# EasyEDA schematic P01_POWER_USB.json
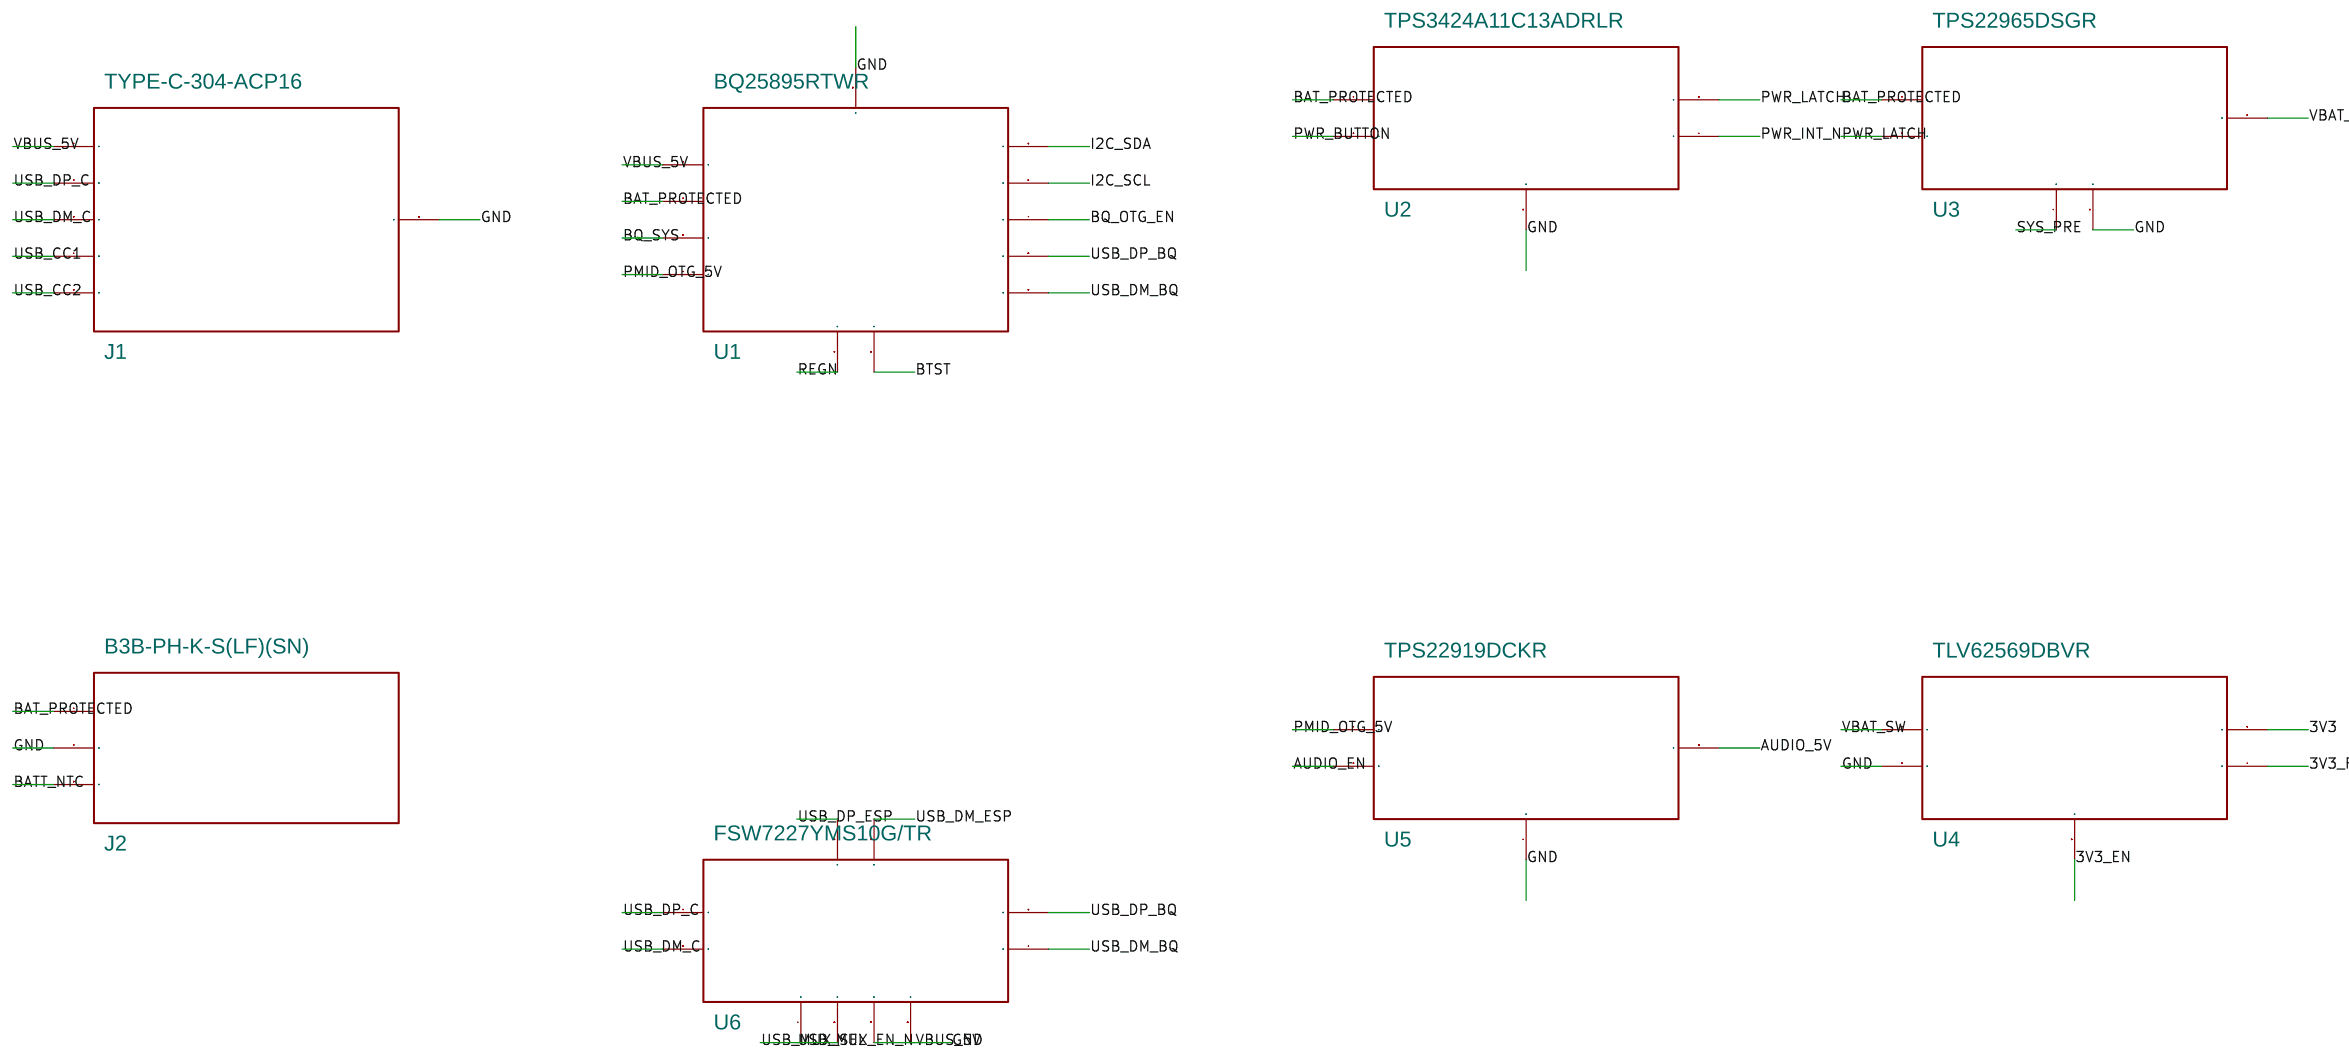
[diagram p0: schematic sheet]

## Parts
J1  TYPE-C-304-ACP16  [USB-C-16P]
J2  B3B-PH-K-S(LF)(SN)  [JST-PH-3P]
U1  BQ25895RTWR  [WQFN-24]
U2  TPS3424A11C13ADRLR  [VSON-8]
U3  TPS22965DSGR  [WSON-8]
U4  TLV62569DBVR  [SOT-23-5]
U5  TPS22919DCKR  [SC-70-6]
U6  FSW7227YMS10G/TR  [MSOP-10]

## Library data of the parts
J1 J2 = Connector
U1 = BQ25895
U2 = Pushbutton_Controller
U3 U5 = Load_Switch
U4 = Buck_Regulator
U6 = USB2_Mux

## Nets
3V3: U4.3(1)
3V3_EN: U4.5(1)
3V3_FB: U4.4(1)
GND: J1.1 J1.6(1) J2.2(1) U1.1 U1.10(1) U2.5(1) U3.5(1) U4.2(1) U5.4(1) U6.9(1) U6.10(1)
VBAT_SW: U3.3(1) U4.1
AUDIO_5V: U5.3(1)
AUDIO_EN: U5.2(1)
BAT_PROTECTED: J2.1 U1.2(1) U2.1 U3.1
BATT_NTC: J2.3(1)
BQ_OTG_EN: U1.7(1)
BQ_SYS: U1.3(1)
BTST: U1.12(1)
I2C_SCL: U1.6(1)
I2C_SDA: U1.5(1)
PMID_OTG_5V: U1.4(1) U5.1
PWR_BUTTON: U2.2(1)
PWR_INT_N: U2.4(1)
PWR_LATCH: U2.3(1) U3.2(1)
REGN: U1.11(1)
SYS_PRE: U3.4(1)
USB_CC1: J1.4(1)
USB_CC2: J1.5(1)
USB_DM_BQ: U1.9(1) U6.4(1)
USB_DM_C: J1.3(1) U6.2(1)
USB_DM_ESP: U6.6(1)
USB_DP_BQ: U1.8(1) U6.3(1)
USB_DP_C: J1.2(1) U6.1
USB_DP_ESP: U6.5(1)
USB_MUX_EN_N: U6.7(1) U6.8(1)

## Notes on the sheet
- P01  电源、充电、USB MUX 与硬件电源锁存
- 已确认：BQ25895 + TPS3424 + TPS22965；VBAT_SW 不得来自 BQ_SYS。
- 推荐初值：RILIM≈180Ω、ICHG≈1.5A、PMID 60uF、USB CC=5.1kΩ Rd。
- 样机验证：USB 异常电压、OTG 启动、上电顺序、4G 峰值掉压和强制选路互斥。
- CC1 5.1k Rd
- CC2 5.1k Rd
- PMID 60uF / REGN 4.7uF
- RILIM 180R / ICHG 1.5A
- 2.2uH / FB 453k+100k
